# EAGLE design ioboard (EAGLE 9.6.2)
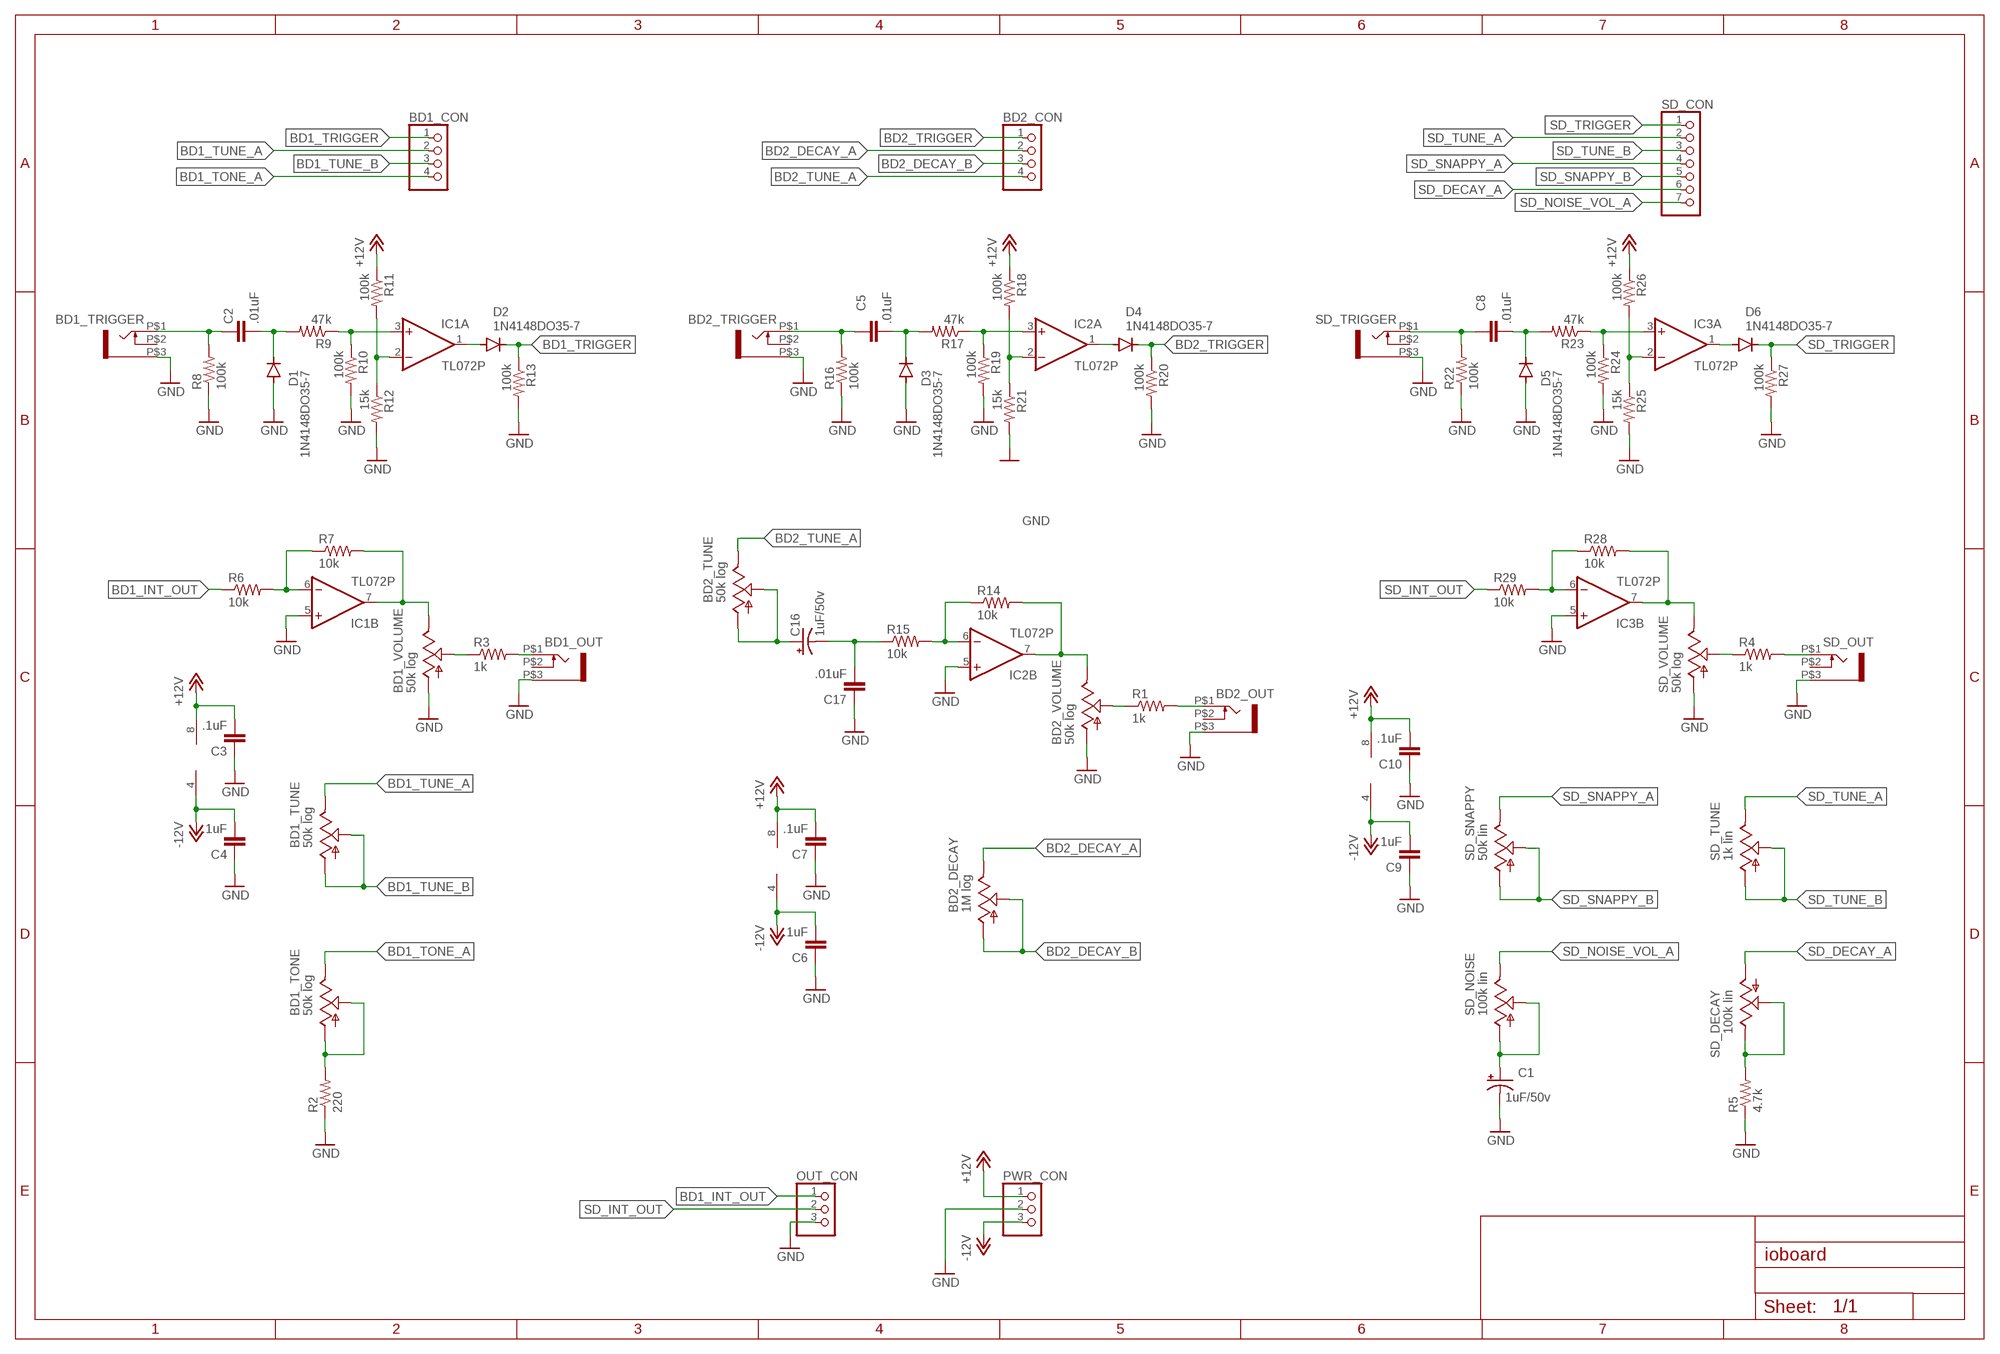
[diagram p0: schematic, sheet 1]

## Parts
BD1_CON  PINHD-1X4  [1X04]
BD1_OUT  WQP-PJ301M-12_JACK  [WQP-PJ301M-12_JACK]
BD1_TONE  50k log  ALPHA-9MMA  [EVUF]
BD1_TRIGGER  WQP-PJ301M-12_JACK  [WQP-PJ301M-12_JACK]
BD1_TUNE  50k log  ALPHA-9MMA  [EVUF]
BD1_VOLUME  50k log  ALPHA-9MMA  [EVUF]
BD2_CON  PINHD-1X4  [1X04]
BD2_DECAY  1M log  ALPHA-9MMA  [EVUF]
BD2_OUT  WQP-PJ301M-12_JACK  [WQP-PJ301M-12_JACK]
BD2_TRIGGER  WQP-PJ301M-12_JACK  [WQP-PJ301M-12_JACK]
BD2_TUNE  50k log  ALPHA-9MMA  [EVUF]
BD2_VOLUME  50k log  ALPHA-9MMA  [EVUF]
C1  1uF/50v  CPOL-USE2.5-5  [E2,5-5]
C2  .01uF  C-EU050-024X044  [C050-024X044]
C3  .1uF  C-EU050-024X044  [C050-024X044]
C4  .1uF  C-EU050-024X044  [C050-024X044]
C5  .01uF  C-EU050-024X044  [C050-024X044]
C6  .1uF  C-EU050-024X044  [C050-024X044]
C7  .1uF  C-EU050-024X044  [C050-024X044]
C8  .01uF  C-EU050-024X044  [C050-024X044]
C9  .1uF  C-EU050-024X044  [C050-024X044]
C10  .1uF  C-EU050-024X044  [C050-024X044]
C16  1uF/50v  CPOL-USE2.5-6  [E2,5-6]
C17  .01uF  C-EU050-024X044  [C050-024X044]
D1  1N4148DO35-7  [DO35-7]
D2  1N4148DO35-7  [DO35-7]
D3  1N4148DO35-7  [DO35-7]
D4  1N4148DO35-7  [DO35-7]
D5  1N4148DO35-7  [DO35-7]
D6  1N4148DO35-7  [DO35-7]
IC1  TL072P  [DIL08]
IC2  TL072P  [DIL08]
IC3  TL072P  [DIL08]
OUT_CON  PINHD-1X3  [1X03]
PWR_CON  PINHD-1X3  [1X03]
R1  1k  R-US_0207/7  [0207/7]
R2  220  R-US_0207/7  [0207/7]
R3  1k  R-US_0207/7  [0207/7]
R4  1k  R-US_0207/7  [0207/7]
R5  4.7k  R-US_0207/7  [0207/7]
R6  10k  R-US_0207/7  [0207/7]
R7  10k  R-US_0207/7  [0207/7]
R8  100k  R-US_0207/7  [0207/7]
R9  47k  R-US_0207/7  [0207/7]
R10  100k  R-US_0207/7  [0207/7]
R11  100k  R-US_0207/7  [0207/7]
R12  15k  R-US_0207/7  [0207/7]
R13  100k  R-US_0207/7  [0207/7]
R14  10k  R-US_0207/7  [0207/7]
R15  10k  R-US_0207/7  [0207/7]
R16  100k  R-US_0207/7  [0207/7]
R17  47k  R-US_0207/7  [0207/7]
R18  100k  R-US_0207/7  [0207/7]
R19  100k  R-US_0207/7  [0207/7]
R20  100k  R-US_0207/7  [0207/7]
R21  15k  R-US_0207/7  [0207/7]
R22  100k  R-US_0207/7  [0207/7]
R23  47k  R-US_0207/7  [0207/7]
R24  100k  R-US_0207/7  [0207/7]
R25  15k  R-US_0207/7  [0207/7]
R26  100k  R-US_0207/7  [0207/7]
R27  100k  R-US_0207/7  [0207/7]
R28  10k  R-US_0207/7  [0207/7]
R29  10k  R-US_0207/7  [0207/7]
SD_CON  PINHD-1X7  [1X07]
SD_DECAY  100k lin  ALPHA-9MMA  [EVUF]
SD_NOISE  100k lin  ALPHA-9MMA  [EVUF]
SD_OUT  WQP-PJ301M-12_JACK  [WQP-PJ301M-12_JACK]
SD_SNAPPY  50k lin  ALPHA-9MMA  [EVUF]
SD_TRIGGER  WQP-PJ301M-12_JACK  [WQP-PJ301M-12_JACK]
SD_TUNE  1k lin  ALPHA-9MMA  [EVUF]
SD_VOLUME  50k log  ALPHA-9MMA  [EVUF]

## Nets
+12V: C3.2 C7.2 C10.2 IC1.8(P:V+) IC2.8(P:V+) IC3.8(P:V+) PWR_CON.1 R11.1 R18.1 R26.1
-12V: C4.2 C6.2 C9.2 IC1.4(P:V-) IC2.4(P:V-) IC3.4(P:V-) PWR_CON.3
BD1_INT_OUT: OUT_CON.1 R6.1
BD1_OUT: BD1_OUT.P$1 R3.2
BD1_TONE_A: BD1_CON.4 BD1_TONE.3(E)
BD1_TONE_B: BD1_TONE.1(A) BD1_TONE.2(S) R2.2
BD1_TRIGGER: BD1_CON.1 D2.C R13.1
BD1_TUNE_A: BD1_CON.2 BD1_TUNE.3(E)
BD1_TUNE_B: BD1_CON.3 BD1_TUNE.1(A) BD1_TUNE.2(S)
BD2_DECAY_A: BD2_CON.2 BD2_DECAY.3(E)
BD2_DECAY_B: BD2_CON.3 BD2_DECAY.1(A) BD2_DECAY.2(S)
BD2_INT_OUT: C16.- C17.2 R15.1
BD2_TRIGGER: BD2_CON.1 D4.C R20.1
BD2_TUNE_A: BD2_CON.4 BD2_TUNE.3(E)
BD2_TUNE_B: BD2_TUNE.1(A) BD2_TUNE.2(S) C16.+
GND: BD1_OUT.P$3 BD1_TRIGGER.P$3 BD1_VOLUME.1(A) BD2_OUT.P$3 BD2_TRIGGER.P$3 BD2_VOLUME.1(A) C1.- C3.1 C4.1 C6.1 C7.1 C9.1 C10.1 C17.1 D1.A D3.A D5.A IC1.5(B:+IN) IC2.5(B:+IN) IC3.5(B:+IN) OUT_CON.3 PWR_CON.2 R2.1 R5.1 R8.1 R10.2 R12.2 R13.2 R16.1 R19.2 R20.2 R21.2 R22.1 R24.2 R25.2 R27.2 SD_OUT.P$3 SD_TRIGGER.P$3 SD_VOLUME.1(A)
N$1: BD1_VOLUME.2(S) R3.1
N$2: R4.1 SD_VOLUME.2(S)
N$3: BD2_OUT.P$1 R1.2
N$4: BD2_VOLUME.2(S) R1.1
N$5: R4.2 SD_OUT.P$1
N$6: IC1.6(B:-IN) R6.2 R7.1
N$7: R5.2 SD_DECAY.2(S) SD_DECAY.3(E)
N$8: BD1_TRIGGER.P$1 C2.1 R8.2
N$9: C2.2 D1.C R9.2
N$10: IC1.3(A:+IN) R9.1 R10.1
N$11: IC1.2(A:-IN) R11.2 R12.1
N$12: D2.A IC1.1(A:OUT)
N$13: BD2_VOLUME.3(E) IC2.7(B:OUT) R14.2
N$14: IC2.6(B:-IN) R14.1 R15.2
N$15: BD2_TRIGGER.P$1 C5.1 R16.2
N$16: C5.2 D3.C R17.2
N$17: IC2.3(A:+IN) R17.1 R19.1
N$18: D4.A IC2.1(A:OUT)
N$19: IC3.6(B:-IN) R28.1 R29.2
N$20: IC2.2(A:-IN) R18.2 R21.1
N$21: C8.1 R22.2 SD_TRIGGER.P$1
N$22: C8.2 D5.C R23.2
N$23: IC3.3(A:+IN) R23.1 R24.1
N$24: IC3.2(A:-IN) R25.1 R26.2
N$25: D6.A IC3.1(A:OUT)
N$26: IC3.7(B:OUT) R28.2 SD_VOLUME.3(E)
N$99: BD1_VOLUME.3(E) IC1.7(B:OUT) R7.2
SD_DECAY_A: SD_CON.6 SD_DECAY.1(A)
SD_INT_OUT: OUT_CON.2 R29.1
SD_NOISE_B: C1.+ SD_NOISE.1(A) SD_NOISE.2(S)
SD_NOISE_VOL_A: SD_CON.7 SD_NOISE.3(E)
SD_SNAPPY_A: SD_CON.4 SD_SNAPPY.3(E)
SD_SNAPPY_B: SD_CON.5 SD_SNAPPY.1(A) SD_SNAPPY.2(S)
SD_TRIGGER: D6.C R27.1 SD_CON.1
SD_TUNE_A: SD_CON.2 SD_TUNE.3(E)
SD_TUNE_B: SD_CON.3 SD_TUNE.1(A) SD_TUNE.2(S)
Unconnected: BD1_OUT.P$2 BD1_TRIGGER.P$2 BD2_OUT.P$2 BD2_TRIGGER.P$2 SD_OUT.P$2 SD_TRIGGER.P$2

## Library data of the parts
BD1_CON BD2_CON = pinhead:PINHD-1X4: PIN HEADER
BD1_OUT BD1_TRIGGER BD2_OUT BD2_TRIGGER SD_OUT SD_TRIGGER = thonkiconn:WQP-PJ301M-12_JACK
BD1_TONE BD1_TUNE BD1_VOLUME BD2_DECAY BD2_TUNE BD2_VOLUME SD_DECAY SD_NOISE SD_SNAPPY SD_TUNE SD_VOLUME = TomW:ALPHA-9MM: 9 mm Square Rotary Potentiometers Source: Panasonic
C1 C16 = rcl:CPOL-US: POLARIZED CAPACITOR, American symbol; SPICEPREFIX: C
C2-C10 = rcl:C-EU: CAPACITOR, European symbol; SPICEPREFIX: C
C17 = resistor:C-EU: CAPACITOR, European symbol
D1-D6 = diode:1N4148: DIODE high speed (Philips)
IC1-IC3 = TomW:TL072: OP AMP
OUT_CON PWR_CON = pinhead:PINHD-1X3: PIN HEADER
R1-R29 = rcl:R-US_: RESISTOR, American symbol; SPICEPREFIX: R
SD_CON = pinhead:PINHD-1X7: PIN HEADER

## Board
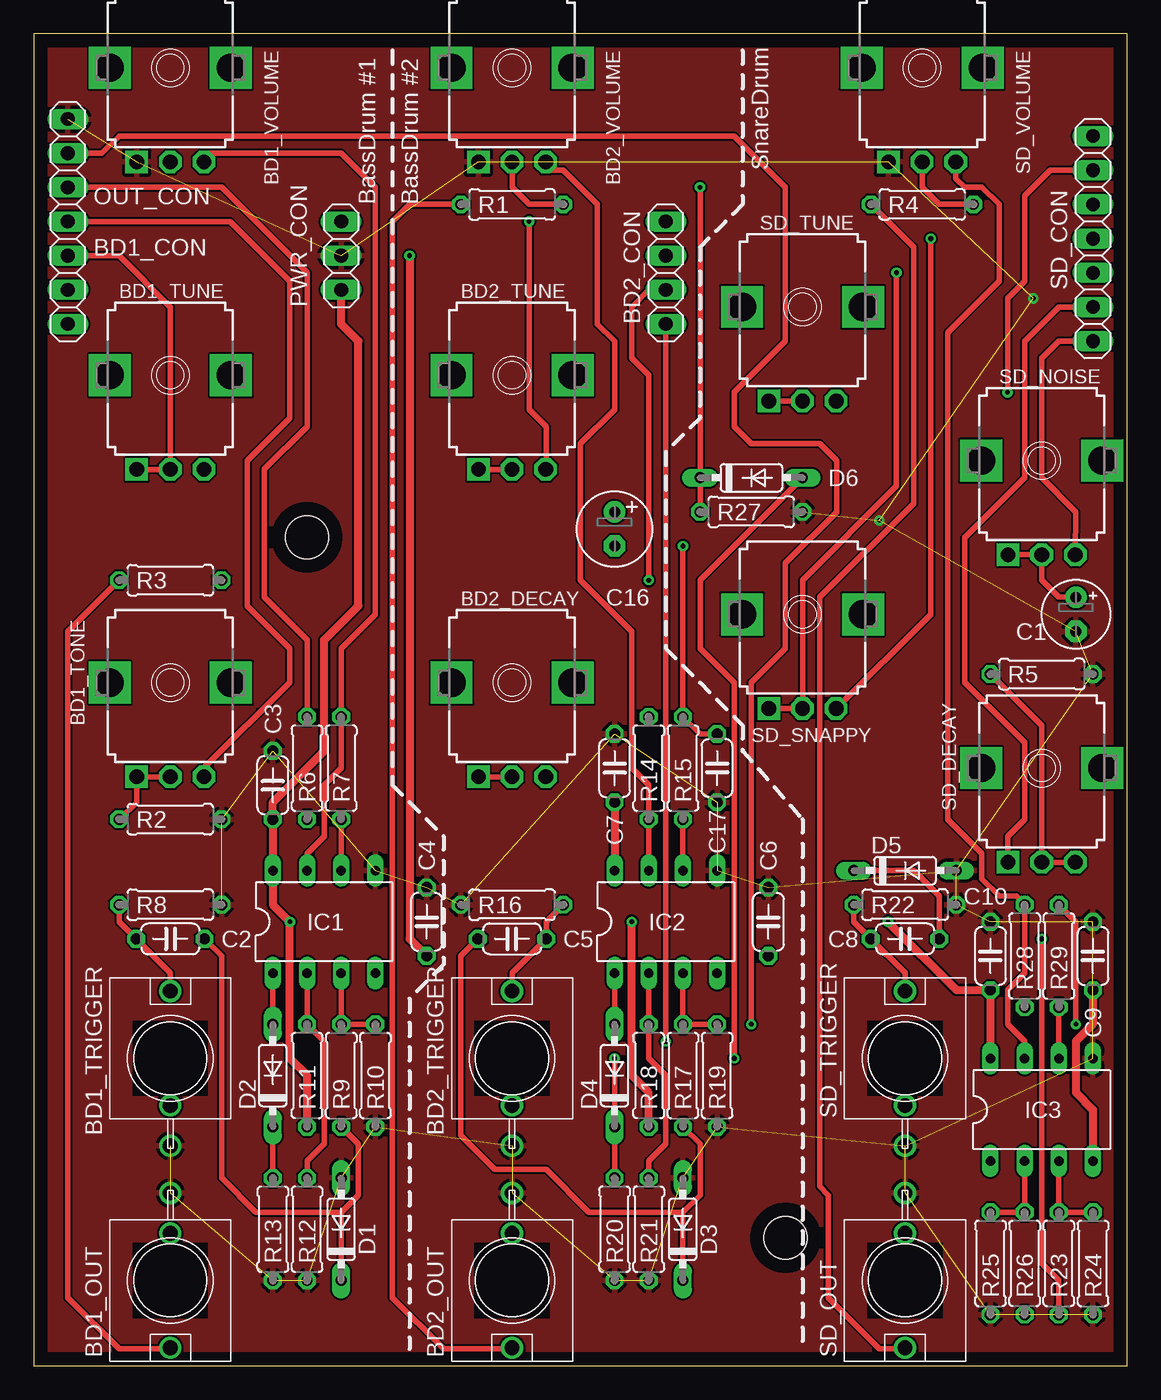
[diagram p1: board, top side]
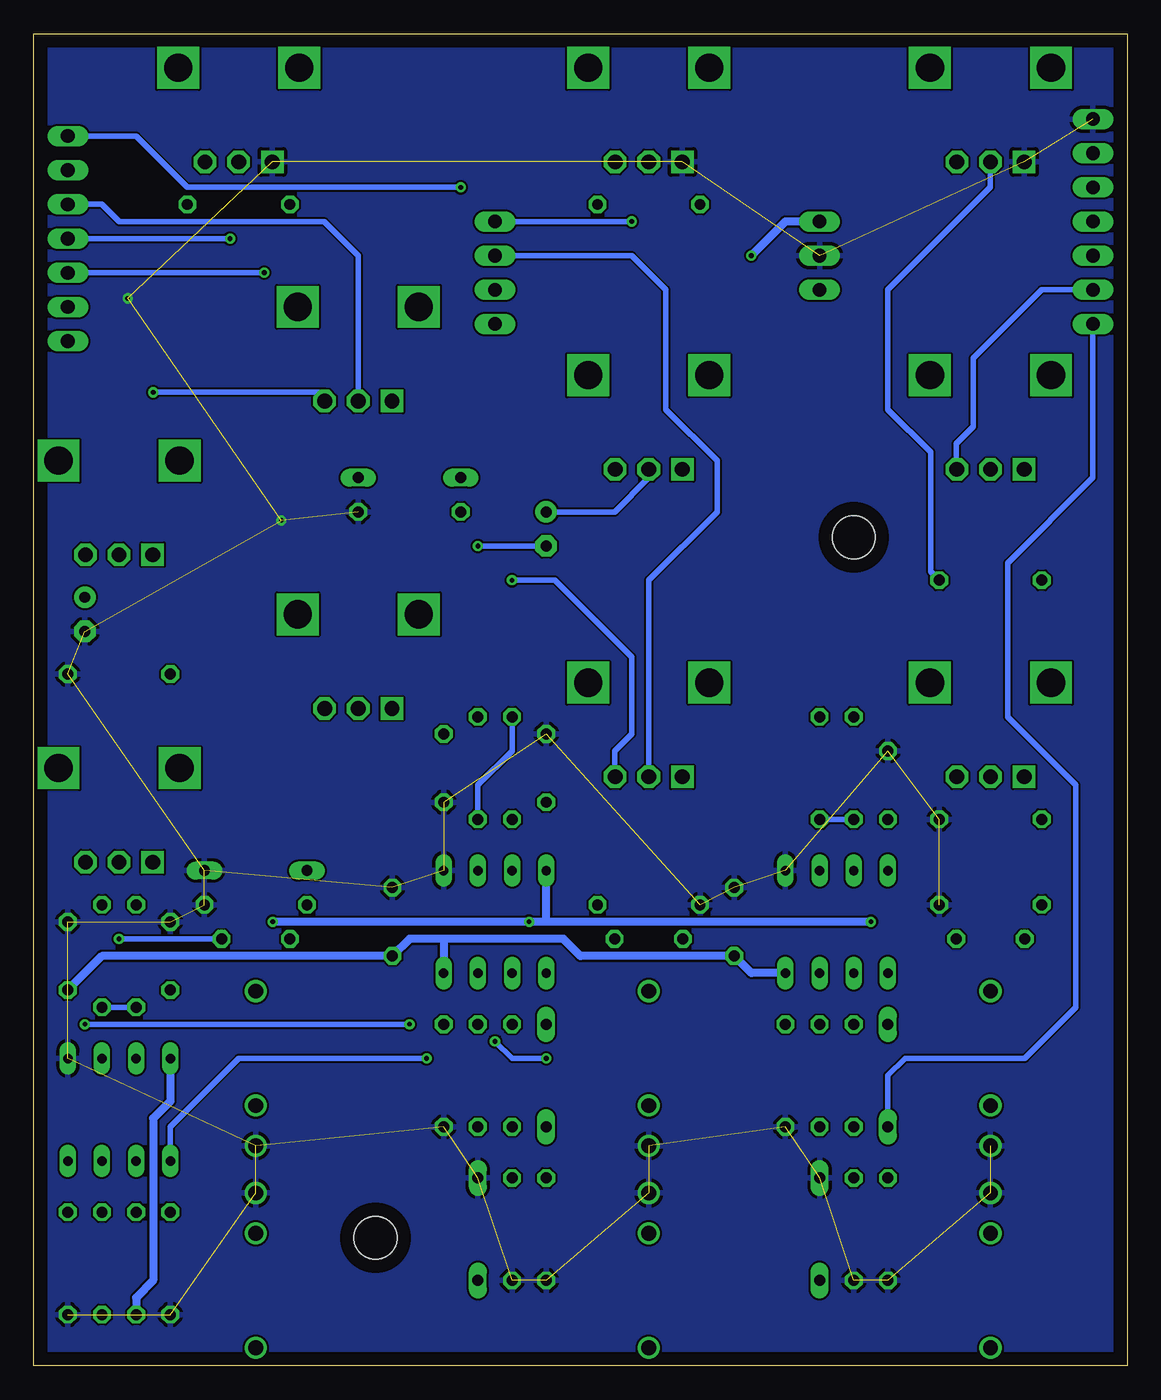
[diagram p2: board, bottom side, seen from below]

Size 81.28 x 99.06 mm. Coordinates in mm from the lower left corner, seen from the top.
Outline: 0,0 81.28,0 81.28,99.06 0,99.06 0,0
Copper layers (1*16): Top 0.035mm / dielectric 1.5mm / Bottom 0.035mm
Design rules "default": minimum track width 6mil, minimum drill 0.35mm, track to track 6mil, track to pad 6mil, pad to pad 6mil, via to via 6mil, smd to smd 6mil, copper to edge 40mil, drill to drill 6mil, minimum pad ring 10mil, minimum via ring 8mil, stop-mask expansion 4mil, vias tented up to drill 0mil, thermal gap 10mil
Holes 3.2 mm at 55.88,9.53 20.32,61.59

### Footprints (pad centres in the part's own frame; a part is rotated, then mirrored left to right if it is on the bottom)
1X04 = drill 1.016 long: 1 -3.81,0; 2 -1.27,0; 3 1.27,0; 4 3.81,0
WQP-PJ301M-12_JACK = drill 1.1: P$1 0,5; P$2 0,-3.5; P$3 0,-6.5
EVUF = drill 1.1 pad 1.676 square: 1 -2.5,-7 | drill 1.1 pad 1.676 octagon: 2 0,-7; 3 2.5,-7 | drill 2.1 pad 2.8 square: M1 4.5,0; M2 -4.5,0
E2,5-5 = drill 0.813 pad 1.6: + -1.27,0 | drill 0.813 pad 1.6 octagon: - 1.27,0
C050-024X044 = drill 0.813 octagon: 1 -2.54,0; 2 2.54,0
E2,5-6 = drill 0.813 pad 1.6: + -1.27,0 | drill 0.813 pad 1.6 octagon: - 1.27,0
DO35-7 = drill 0.813 long: A 3.81,0; C -3.81,0
DIL08 = drill 0.7 long: 1 -3.81,-3.81; 2 -1.27,-3.81; 3 1.27,-3.81; 4 3.81,-3.81; 5 3.81,3.81; 6 1.27,3.81; 7 -1.27,3.81; 8 -3.81,3.81
1X03 = drill 1.016 long: 1 -2.54,0; 2 0,0; 3 2.54,0
0207/7 = drill 0.813 octagon: 1 -3.81,0; 2 3.81,0
1X07 = drill 1.016 long: 1 -7.62,0; 2 -5.08,0; 3 -2.54,0; 4 0,0; 5 2.54,0; 6 5.08,0; 7 7.62,0

### Placement (x,y rotation side)
BD1_CON  2.54,81.28 90 top
BD1_OUT  10.16,6.35 180 top
BD1_TONE  10.16,50.8 0 top
BD1_TRIGGER  10.16,22.86 0 top
BD1_TUNE  10.16,73.66 0 top
BD1_VOLUME  10.16,96.52 0 top
BD2_CON  46.99,81.28 90 top
BD2_DECAY  35.56,50.8 0 top
BD2_OUT  35.56,6.35 180 top
BD2_TRIGGER  35.56,22.86 0 top
BD2_TUNE  35.56,73.66 0 top
BD2_VOLUME  35.56,96.52 0 top
C1  77.47,55.88 270 top
C2  10.16,31.75 0 top
C3  17.78,43.18 270 top
C4  29.21,33.02 270 top
C5  35.56,31.75 180 top
C6  54.61,33.02 270 top
C7  43.18,44.45 270 top
C8  64.77,31.75 0 top
C9  78.74,30.48 270 top
C10  71.12,30.48 270 top
C16  43.18,62.23 270 top
C17  50.8,44.45 90 top
D1  22.86,10.16 90 top
D2  17.78,21.59 90 top
D3  48.26,10.16 90 top
D4  43.18,21.59 90 top
D5  64.77,36.83 0 top
D6  53.34,66.04 0 top
IC1  21.59,33.02 0 top
IC2  46.99,33.02 0 top
IC3  74.93,19.05 0 top
OUT_CON  2.54,90.17 90 top
PWR_CON  22.86,82.55 90 top
R1  35.56,86.36 180 top
R2  10.16,40.64 180 top
R3  10.16,58.42 180 top
R4  66.04,86.36 180 top
R5  74.93,51.44 180 top
R6  20.32,44.45 270 top
R7  22.86,44.45 90 top
R8  10.16,34.29 180 top
R9  22.86,21.59 270 top
R10  25.4,21.59 270 top
R11  20.32,21.59 90 top
R12  20.32,10.16 270 top
R13  17.78,10.16 270 top
R14  45.72,44.45 270 top
R15  48.26,44.45 270 top
R16  35.56,34.29 0 top
R17  48.26,21.59 270 top
R18  45.72,21.59 90 top
R19  50.8,21.59 270 top
R20  43.18,10.16 270 top
R21  45.72,10.16 270 top
R22  64.77,34.29 180 top
R23  76.2,7.62 270 top
R24  78.74,7.62 270 top
R25  71.12,7.62 270 top
R26  73.66,7.62 90 top
R27  53.34,63.5 0 top
R28  73.66,30.48 90 top
R29  76.2,30.48 270 top
SD_CON  78.74,83.82 270 top
SD_DECAY  74.93,44.45 0 top
SD_NOISE  74.93,67.31 0 top
SD_OUT  64.77,6.35 180 top
SD_SNAPPY  57.15,55.88 0 top
SD_TRIGGER  64.77,22.86 0 top
SD_TUNE  57.15,78.74 0 top
SD_VOLUME  66.04,96.52 0 top

### Tracks (layer width: path | path; a pad name or v marks a point on that pad's centre or on a via)
+12V  (via drill 0.35)
  Top 0.61: C7.2 IC2.8 | IC3.8 C10.2 68.58,27.94 v63.5,33.02 | R18.1 45.72,20.32 44.45,21.59 v44.45,33.02 | R11.1 20.32,21.59 19.05,22.86 v19.05,33.02 17.78,34.29 IC1.8 C3.2 17.78,41.91 21.59,45.72 21.59,53.98 24.13,56.52 24.13,76.2 22.86,77.47 PWR_CON.1
  Bottom 0.61: v19.05,33.02 43.18,33.02 | 43.18,33.02 IC2.8 | 43.18,33.02 v44.45,33.02 v63.5,33.02 | IC3.8 71.12,19.68 72.39,18.41 72.39,6.35 73.66,5.08 R26.1
-12V  (via drill 0.35)
  Top 0.61: C9.2 78.74,25.4 77.47,24.13 77.47,20.32 78.74,19.05 IC3.4 | C4.2 27.94,31.75 v27.94,82.55
  Bottom 0.61: IC1.4 27.94,29.21 C4.2 40.64,30.48 41.91,31.75 50.8,31.75 | 50.8,31.75 IC2.4 | 50.8,31.75 53.34,31.75 C6.2 76.2,30.48 C9.2 | PWR_CON.3 25.4,85.09 v27.94,82.55
BD1_INT_OUT
  Top 0.406: OUT_CON.1 13.97,87.63 20.32,81.28 20.32,69.85 17.14,66.67 17.14,57.15 20.32,53.98 R6.1
BD1_OUT
  Top 0.406: BD1_OUT.P$1 10.16,1.27 6.35,1.27 2.54,5.08 2.54,54.61 R3.2
BD1_TONE_A
  Top 0.406: BD1_CON.4 14.61,85.09 19.05,80.64 19.05,70.48 15.88,67.31 15.88,56.52 19.05,53.34 19.05,50.8 12.66,44.45 BD1_TONE.3
BD1_TONE_B
  Top 0.406: R2.2 7.66,41.91 BD1_TONE.1 BD1_TONE.2
BD1_TRIGGER
  Top 0.406: D2.C R13.1
  Bottom 0.406: BD1_CON.1 2.54,66.04 8.89,59.69 8.89,48.26 3.81,43.18 3.81,26.67 7.62,22.86 16.51,22.86 17.78,21.59 D2.C
BD1_TUNE_A
  Bottom 0.406: BD1_CON.2 6.35,80.01 11.43,74.93 11.43,69.85 12.7,68.58 12.7,66.66 BD1_TUNE.3
BD1_TUNE_B
  Top 0.406: BD1_TUNE.1 BD1_TUNE.2 10.16,78.74 6.35,82.55 BD1_CON.3
BD2_DECAY_A  (via drill 0.35)
  Top 0.406: v45.72,58.42 45.72,73.66 44.45,74.93 44.45,78.74 45.72,80.01 BD2_CON.2
  Bottom 0.406: BD2_DECAY.3 arc60 38.1,43.81 38.1,45.72 36.83,46.99 36.83,52.7 42.55,58.42 v45.72,58.42
BD2_DECAY_B
  Top 0.406: BD2_DECAY.1 BD2_DECAY.2
  Bottom 0.406: BD2_DECAY.2 35.56,58.42 30.48,63.5 30.48,67.31 34.29,71.12 34.29,80.01 36.83,82.55 BD2_CON.3
BD2_INT_OUT  (via drill 0.35)
  Top 0.406: C17.2 49.53,46.99 R15.1 v48.26,60.96
  Bottom 0.406: C16.- v48.26,60.96
BD2_TRIGGER  (via drill 0.35)
  Top 0.406: R20.1 D4.C v43.18,22.86 | BD2_CON.1 v46.99,24.13
  Bottom 0.406: v46.99,24.13 45.72,22.86 v43.18,22.86
BD2_TUNE_A  (via drill 0.35)
  Top 0.406: v36.83,85.09 36.83,71.12 38.1,69.85 38.1,66.66 BD2_TUNE.3
  Bottom 0.406: BD2_CON.4 v36.83,85.09
BD2_TUNE_B
  Top 0.406: BD2_TUNE.1 BD2_TUNE.2
  Bottom 0.406: BD2_TUNE.2 35.56,66.04 38.1,63.5 C16.+
GND  (via drill 0.35)  (40 unrouted)
  other vias: 74.3,79.38 62.87,62.87
  pour Bottom: 0,99.06 0,0 81.28,0 81.28,99.06
  pour Top: 0,99.06 0,0 81.28,0 81.28,99.06
N$1
  Bottom 0.406: R3.1 14.61,59.05 14.61,67.94 17.78,71.12 17.78,80.01 10.16,87.63 BD1_VOLUME.2
N$2
  Top 0.406: R4.1 67.31,86.36 66.04,87.63 SD_VOLUME.2
N$3
  Top 0.406: BD2_OUT.P$1 35.56,1.27 30.48,1.27 26.67,5.08 26.67,85.09 27.94,86.36 R1.2
N$4
  Top 0.406: R1.1 36.83,86.36 35.56,87.63 BD2_VOLUME.2
N$5
  Top 0.406: SD_OUT.P$1 64.77,1.27 62.87,1.27 59.05,5.08 59.05,12.7 58.42,13.34 58.42,57.15 65.41,64.14 65.41,83.19 R4.2
N$6
  Top 0.406: R7.1 IC1.6
  Bottom 0.406: R6.2 R7.1
N$7
  Top 0.406: R5.2 74.93,47.62 SD_DECAY.2 SD_DECAY.3
N$8
  Top 0.406: R8.2 6.35,33.02 C2.1 10.16,29.21 BD1_TRIGGER.P$1
N$9
  Top 0.406: C2.2 13.97,30.48 13.97,13.97 16.51,11.43 22.86,11.43 | 22.86,11.43 D1.C | R9.2 24.13,16.51 24.13,12.7 22.86,11.43
N$10
  Top 0.406: IC1.3 R9.1 R10.1
N$11
  Top 0.406: R12.1 20.32,15.24 21.59,16.51 21.59,24.13 R11.2 IC1.2
N$12
  Top 0.406: IC1.1 D2.A
N$13
  Top 0.406: IC2.7 R14.2 45.72,43.18 44.45,44.45 44.45,54.61 40.64,58.42 40.64,68.58 43.18,71.12 43.18,76.2 41.91,77.47 41.91,86.36 39.37,88.9 38.1,88.9 38.1,89.52 BD2_VOLUME.3
N$14
  Top 0.406: R15.2 IC2.6
  Bottom 0.406: R14.1 45.72,45.72 48.26,43.18 R15.2
N$15
  Top 0.406: R16.2 38.1,33.02 C5.1 35.56,29.21 BD2_TRIGGER.P$1
N$16
  Top 0.406: 48.26,11.43 41.27,11.43 38.1,14.61 34.29,14.61 31.75,17.14 31.75,30.48 C5.2 | D3.C 48.26,11.43 | R17.2 49.53,16.51 49.53,12.7 48.26,11.43
N$17
  Top 0.406: IC2.3 R17.1 R19.1
N$18
  Top 0.406: IC2.1 D4.A
N$19
  Top 0.406: IC3.6 R29.2
  Bottom 0.406: R29.2 R28.1
N$20
  Top 0.406: IC2.2 R18.2 45.72,22.86 46.99,21.59 46.99,16.51 45.72,15.24 R21.1
N$21
  Top 0.406: R22.2 60.96,33.02 C8.1 64.77,29.21 SD_TRIGGER.P$1
N$22  (via drill 0.35)
  Top 0.406: C8.2 67.31,34.92 65.41,36.83 D5.C | v74.93,31.75 74.93,7.62 76.2,6.35 R23.2
  Bottom 0.406: C8.2 v74.93,31.75
N$23
  Top 0.406: IC3.3 R23.1 R24.1
N$24
  Top 0.406: IC3.2 R26.2 R25.1
N$25  (via drill 0.35)
  Top 0.406: D6.A 49.53,58.42 49.53,53.34 52.07,50.8 v52.07,22.86
  Bottom 0.406: v52.07,22.86 66.04,22.86 71.12,17.78 IC3.1
N$26
  Top 0.406: SD_VOLUME.3 68.53,88.27 69.22,87.63 70.48,87.63 71.75,86.36 71.75,80.64 67.94,76.83 67.94,40.64 70.48,38.1 70.48,36.2 71.75,34.92 73.03,34.92 R28.2 73.66,29.21 72.39,27.94 72.39,25.4 73.66,24.13 IC3.7
N$99
  Top 0.406: BD1_VOLUME.3 12.66,90.17 22.86,90.17 25.4,87.63 25.4,55.88 22.86,53.34 R7.2 22.86,44.45 21.59,43.18 21.59,39.37 20.32,38.1 IC1.7
SD_DECAY_A
  Top 0.406: SD_CON.6 76.2,78.74 73.66,76.2 73.66,66.04 69.22,61.59 69.22,50.8 73.66,46.35 73.66,40.64 72.39,39.37 72.39,37.45 SD_DECAY.1
SD_INT_OUT  (via drill 0.35)
  Top 0.406: v77.47,25.4 77.47,33.02 R29.1 | OUT_CON.2 5.08,90.17 6.35,91.44 52.07,91.44 55.88,87.63 55.88,76.2 52.07,72.39 52.07,69.85 53.34,68.58 58.42,68.58 59.69,67.31 59.69,63.5 55.88,59.69 55.88,53.34 53.34,50.8 v53.34,25.4
  Bottom 0.406: v77.47,25.4 v53.34,25.4
SD_NOISE_B
  Top 0.406: SD_NOISE.1 SD_NOISE.2 74.93,58.42 76.2,57.15 C1.+
SD_NOISE_VOL_A
  Top 0.406: SD_NOISE.3 77.47,63.5 74.93,66.04 74.93,74.93 76.2,76.2 SD_CON.7
SD_SNAPPY_A  (via drill 0.35)
  Top 0.406: v66.67,83.82 66.67,55.88 59.65,48.9 SD_SNAPPY.3
  Bottom 0.406: SD_CON.4 v66.67,83.82
SD_SNAPPY_B  (via drill 0.35)
  Top 0.406: SD_SNAPPY.1 SD_SNAPPY.2 57.15,58.42 64.14,65.41 v64.14,81.28
  Bottom 0.406: v64.14,81.28 SD_CON.5
SD_TRIGGER  (via drill 0.35)
  Top 0.406: R27.1 D6.C v49.53,87.63
  Bottom 0.406: SD_CON.1 73.66,91.44 69.85,87.63 v49.53,87.63
SD_TUNE_A  (via drill 0.35)
  Top 0.406: SD_CON.2 75.56,88.9 73.66,87 73.66,80.64 72.39,79.38 v72.39,72.39
  Bottom 0.406: SD_TUNE.3 59.65,72.39 v72.39,72.39
SD_TUNE_B
  Top 0.406: SD_TUNE.2 SD_TUNE.1
  Bottom 0.406: SD_CON.3 76.2,86.36 74.93,85.09 59.69,85.09 57.15,82.55 SD_TUNE.2

### Text on the board
tNames: SnareDrum | BassDrum #1 | BassDrum #2